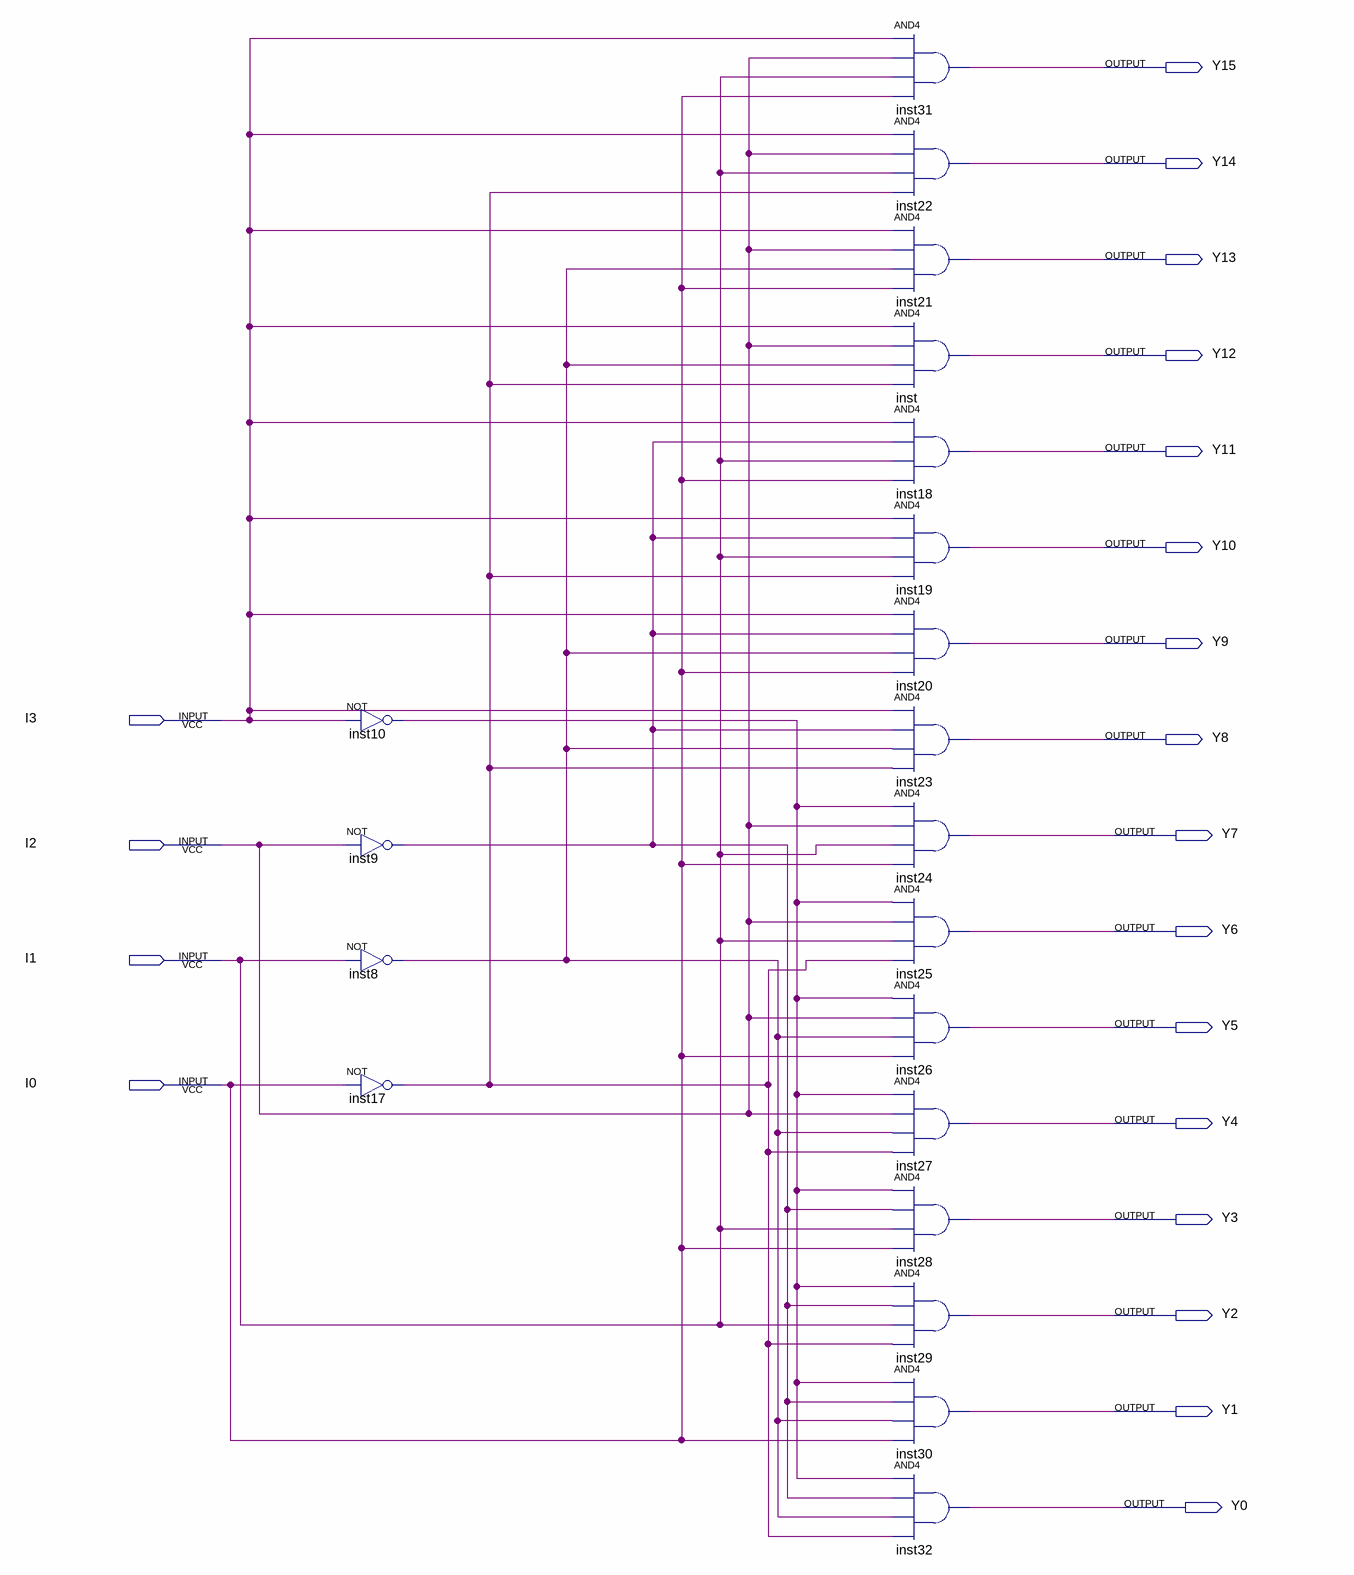
[diagram p0: schematic sheet]
// Quartus schematic 4.bdf as structural Verilog: 20 symbols, 20 pins
module \4  (
  input  I3,
  input  I2,
  input  I1,
  input  I0,
  output Y15,
  output Y14,
  output Y13,
  output Y12,
  output Y11,
  output Y10,
  output Y9,
  output Y8,
  output Y7,
  output Y6,
  output Y5,
  output Y4,
  output Y3,
  output Y2,
  output Y1,
  output Y0
);

  wire inst8_out, inst9_out, inst10_out, inst17_out;

  not inst10 (inst10_out, I3);
  not inst9 (inst9_out, I2);
  not inst8 (inst8_out, I1);
  not inst17 (inst17_out, I0);
  and inst31 (Y15, I3, I2, I1, I0);
  and inst22 (Y14, I3, I2, I1, inst17_out);
  and inst21 (Y13, I3, I2, inst8_out, I0);
  and inst (Y12, I3, I2, inst8_out, inst17_out);
  and inst18 (Y11, I3, inst9_out, I1, I0);
  and inst19 (Y10, I3, inst9_out, I1, inst17_out);
  and inst20 (Y9, I3, inst9_out, inst8_out, I0);
  and inst23 (Y8, I3, inst9_out, inst8_out, inst17_out);
  and inst24 (Y7, inst10_out, I2, I1, I0);
  and inst25 (Y6, inst10_out, I2, I1, inst17_out);
  and inst26 (Y5, inst10_out, I2, inst8_out, I0);
  and inst27 (Y4, inst10_out, I2, inst8_out, inst17_out);
  and inst28 (Y3, inst10_out, inst9_out, I1, I0);
  and inst29 (Y2, inst10_out, inst9_out, I1, inst17_out);
  and inst30 (Y1, inst10_out, inst9_out, inst8_out, I0);
  and inst32 (Y0, inst10_out, inst9_out, inst8_out, inst17_out);
endmodule
